# Altium schematic sheet DM0250_BW235_OV_9282.SchDoc: =project_title
size Tabloid; PageSetup: Record=PageOptions|CenterHorizontal=True|CenterVertical=True|PrintScale=0.71|XCorrection=1.00|YCorrection=1.00|PrintKind=0|BorderSize=5000000|LeftOffset=0|BottomOffset=0|Orientation=2|PaperLength=1000|PaperWidth=1000|Scale=100|PaperSource=7|PrintQuality=-4|MediaType=1|DitherType=10|PrintScaleMode=1|PaperKind=A4; CompanyName: Luxonis Holding; Organization: Luxonis Holding; Address1: 1925 Harmony Park Drive; Address2: Westminster, CO; Address3: 80234; Address4: United States; SheetNumber: 3; SheetTotal: 3
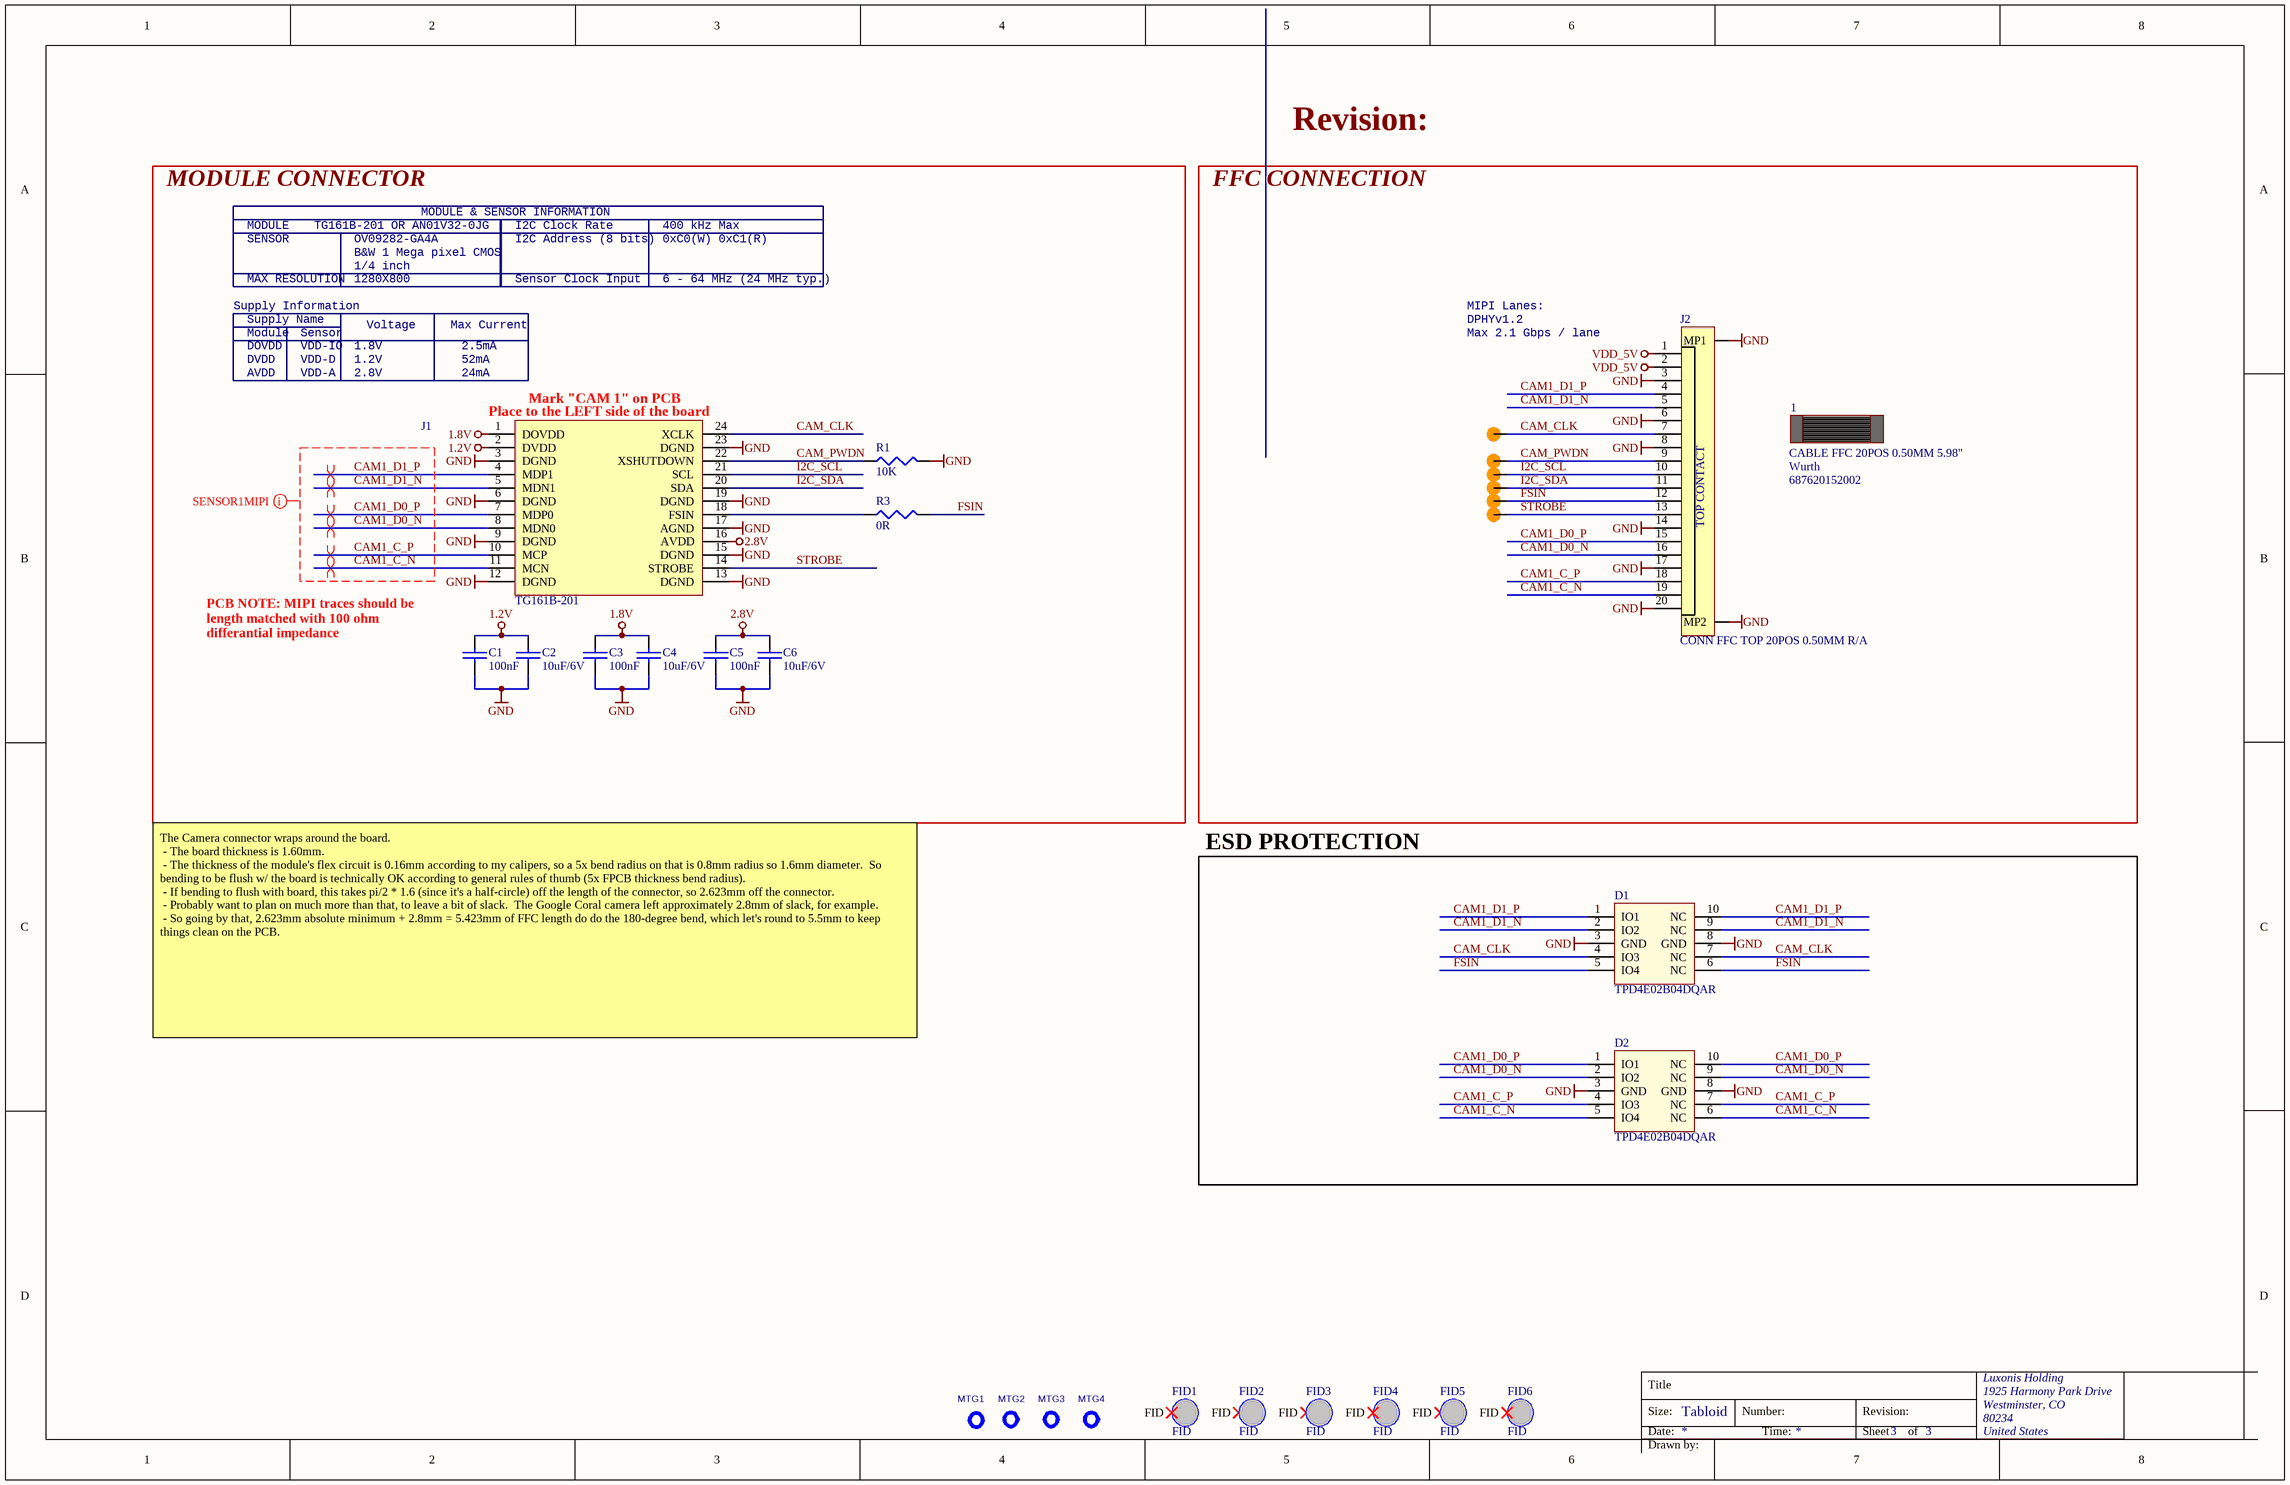
[diagram p0: DM0250_BW235_OV_9282.SchDoc]

## Parts
1  687620152002  ICCO PN: CABLE FFC 20POS 0.50MM 5.98"  MAN: Wurth  (mechanical)
C1  100nF  [0402]
C2  10uF/6V  [0603]
C3  100nF  [0402]
C4  10uF/6V  [0603]
C5  100nF  [0402]
C6  10uF/6V  [0603]
D1  TPD4E02B04DQAR  [TPD4E02B04DQAR]
D2  TPD4E02B04DQAR  [TPD4E02B04DQAR]
FID1  FID  [FIDUCIAL_1MM]  (no BOM)
FID2  FID  [FIDUCIAL_1MM]  (no BOM)
FID3  FID  [FIDUCIAL_1MM]  (no BOM)
FID4  FID  [FIDUCIAL_1MM]  (no BOM)
FID5  FID  [FIDUCIAL_1MM]  (no BOM)
FID6  FID  [FIDUCIAL_1MM]  (no BOM)
J1  TG161B-201  [TG161B-201 / AN01V32 - Board Wrap]
J2  CONN FFC TOP 20POS 0.50MM R/A  [5052782033]
MTG1  MTG-HOLE  [Hole_2.2mm]  (value not drawn)  (no BOM)
MTG2  MTG-HOLE  [Hole_2.2mm]  (value not drawn)  (no BOM)
MTG3  MTG-HOLE  [Hole_2.2mm]  (value not drawn)  (no BOM)
MTG4  MTG-HOLE  [Hole_2.2mm]  (value not drawn)  (no BOM)
R1  10K  [0603]
R3  0R  [0603]
TP1  TP_SMD  [TP_0.75MM_SMD_NO-SILK]  (value not drawn)  (no BOM)
TP2  TP_SMD  [TP_0.75MM_SMD_NO-SILK]  (value not drawn)  (no BOM)
TP3  TP_SMD  [TP_0.75MM_SMD_NO-SILK]  (value not drawn)  (no BOM)
TP4  TP_SMD  [TP_0.75MM_SMD_NO-SILK]  (value not drawn)  (no BOM)
TP5  TP_SMD  [TP_0.75MM_SMD_NO-SILK]  (value not drawn)  (no BOM)
TP6  TP_SMD  [TP_0.75MM_SMD_NO-SILK]  (value not drawn)  (no BOM)

## Blocks framed on the sheet
MODULE CONNECTOR: C1-C6 J1 R1 R3
FFC CONNECTION: 1 J2 TP1-TP6
ESD PROTECTION: D1 D2

## Nets
1.2V: C1.2 C2.2 J1.2(DVDD)
1.8V: C3.2 C4.2 J1.1(DOVDD)
2.8V: C5.2 C6.2 J1.16(AVDD)
GND: C1.1 C2.1 C3.1 C4.1 C5.1 C6.1 D1.3(GND) D1.8(GND) D2.3(GND) D2.8(GND) J1.3(DGND) J1.6(DGND) J1.9(DGND) J1.12(DGND) J1.13(DGND) J1.15(DGND) J1.17(AGND) J1.19(DGND) J1.23(DGND) J2.3 J2.6 J2.8 J2.14 J2.17 J2.20 J2.MP1 J2.MP2 R1.2
VDD_5V: J2.1 J2.2
CAM1_C_N: D2.5(IO4) D2.6(NC) J1.11(MCN) J2.19
CAM1_C_P: D2.4(IO3) D2.7(NC) J1.10(MCP) J2.18
CAM1_D0_N: D2.2(IO2) D2.9(NC) J1.8(MDN0) J2.16
CAM1_D0_P: D2.1(IO1) D2.10(NC) J1.7(MDP0) J2.15
CAM1_D1_N: D1.2(IO2) D1.9(NC) J1.5(MDN1) J2.5
CAM1_D1_P: D1.1(IO1) D1.10(NC) J1.4(MDP1) J2.4
CAM_CLK: D1.4(IO3) D1.7(NC) J1.24(XCLK) J2.7 TP1.1
CAM_PWDN: J1.22(XSHUTDOWN) J2.9 R1.1 TP2.1
FSIN: D1.5(IO4) D1.6(NC) J2.12 R3.2 TP5.1
I2C_SCL: J1.21(SCL) J2.10 TP3.1
I2C_SDA: J1.20(SDA) J2.11 TP4.1
STROBE: J1.14(STROBE) J2.13 TP6.1
NetJ1_18: J1.18(FSIN) R3.1

Not connected (* = marked no-connect by the designer): FID1 FID*; FID2 FID*; FID3 FID*; FID4 FID*; FID5 FID*; FID6 FID*

## Layout directives
differential pair: CAM1_C_N, CAM1_C_P, CAM1_D0_N, CAM1_D0_P, CAM1_D1_N, CAM1_D1_P
net class SENSOR1MIPI: CAM1_C_N, CAM1_C_P, CAM1_D0_N, CAM1_D0_P, CAM1_D1_N, CAM1_D1_P

## Notes on the sheet
- Revision:
- MODULE
- TG161B-201 OR AN01V32-0JG
- MODULE & SENSOR INFORMATION
- I2C Clock Rate
- 400 kHz Max
- SENSOR
- MAX RESOLUTION
- B&W 1 Mega pixel CMOS
- 1280X800
- OV09282-GA4A
- 1/4 inch
- I2C Address (8 bits)
- Sensor Clock Input
- 6 - 64 MHz (24 MHz typ.)
- 0xC0(W) 0xC1(R)
- Supply Information
- DOVDD
- DVDD
- Supply Name
- Module
- VDD-IO
- VDD-D
- Sensor
- 1.8V
- 1.2V
- Voltage
- Max Current
- 2.5mA
- 52mA
- MIPI Lanes:
- Max 2.1 Gbps / lane
- DPHYv1.2
- AVDD
- VDD-A
- 2.8V
- 24mA
- (near J1) Place to the LEFT side of the board
- (near J1) Mark "CAM 1" on PCB
- (near C1) PCB NOTE: MIPI traces should be length matched with 100 ohm differantial impedance
- The Camera connector wraps around the board.
  - The board thickness is 1.60mm.
  - The thickness of the module's flex circuit is 0.16mm according to my calipers, so a 5x bend radius on that is 0.8mm radius so 1.6mm diameter.  So bending to be flush w/ the board is technically OK according to general rules of thumb (5x FPCB thickness bend radius).
  - If bending to flush with board, this takes pi/2 * 1.6 (since it's a half-circle) off the length of the connector, so 2.623mm off the connector.
  - Probably want to plan on much more than that, to leave a bit of slack.  The Google Coral camera left approximately 2.8mm of slack, for example.
  - So going by that, 2.623mm absolute minimum + 2.8mm = 5.423mm of FFC length do do the 180-degree bend, which let's round to 5.5mm to keep things clean on the PCB.
- Title
- Size:
- Date:
- Tabloid
- Number:
- Time:
- Sheet
- of
- Drawn by:
- (in symbol 5052782033) TOP CONTACT

## Library data of the parts
1 = 26 pin FFC cable 15cm: 20 pin FFC cable 15cm; DIST: DigiKey; DIST PN: 732-5165-ND; MAN PN: 687620152002; Manufacturer 1: Wurth; Manufacturer Part Number 1: 687620152002
C1 C3 C5 = CAP: SMD Multilayer Ceramic Capacitor, 0402 [1005 Metric], 0.1 µF, 10 V, ± 10%, X5R; MAN: Kemet; MAN PN: C0402C104K8PACTU; ICCO PN: MV122005; DIST: Farnell; DIST PN: 2392235; Manufacturer 1: Kemet; Manufacturer Part Number 1: C0402C104K8PACTU
C2 C4 C6 = CAP: CC0603MRX5R5BB106  SMD Multilayer Ceramic Capacitor, 0603 [1608 Metric], 10 µF, 6.3 V, ± 20%, X5R; MAN: Yageo(PHYCOM); ICCO PN: MV122009; DIST: Farnell; DIST PN: 1458902; MAN PN: CC0603MRX5R5BB106; Manufacturer 1: Yageo(PHYCOM); Manufacturer Part Number 1: CC0603MRX5R5BB106
D1 D2 = TPD4E02B04DQAR: TVS DIODE 3.6V 8.8V 10USON 8.8V (Typ) Clamp 5A (8/20µs) Ipp Tvs Diode Surface Mount 10-USON (2.5x1); Manufacturer 1: Texas Instruments; Number of Bidirectional Channels: 4; Min Breakdown Voltage: 5.5V; Peak Pulse Power: 17W; Power Line Protection: No; Interface: USB,HDMI; Supplier 1: Digi-Key; Manufacturer Part Number 1: TPD4E02B04DQAR; Stock 1: 25615; Pricing 1: 1=0.69000, 10=0.60800, 100=0.46650, 500=0.36874, 1000=0.29499 (USD); RoHS: Yes; Mount: Surface Mount; Number of Pins: 10; Min Operating Temperature: -40°C; Max Operating Temperature: 125°C; Packaging: Cut Tape; Reverse Standoff Voltage: 3.6V; Clamping Voltage: 8.8V; Operating Supply Voltage: 3.6V; Peak Pulse Current: 5A; Number of Channels: 4; Composition: Zener; REACH SVHC: No SVHC; Lead Free: Lead Free; ComponentLink1URL: http://www.ti.com/general/docs/lit/getliterature.tsp?genericPartNumber=TPD4E02B04&amp;&amp;fileType=pdf&src-supplier=Element14; ComponentLink1Description: http://www.ti.com/general/docs/lit/getliterature.tsp?genericPartNumber=TPD4E02B04&amp;&amp;fileType=pdf&src-supplier=Element14; ComponentLink2URL: http://www.ti.com/lit/ds/symlink/tpd4e02b04.pdf?src-supplier=Farnell; ComponentLink2Description: http://www.ti.com/lit/ds/symlink/tpd4e02b04.pdf?src-supplier=Farnell; ComponentLink3URL: http://www.ti.com/lit/ds/symlink/tpd4e02b04.pdf?src-supplier=Newark; ComponentLink3Description: http://www.ti.com/lit/ds/symlink/tpd4e02b04.pdf?src-supplier=Newark; ComponentLink4URL: http://www.ti.com/lit/ds/symlink/tpd4e02b04.pdf?src-supplier=Digi-Key; ComponentLink4Description: http://www.ti.com/lit/ds/symlink/tpd4e02b04.pdf?src-supplier=Digi-Key; Supplier Part Number 1: 296-43875-1-ND
FID1-FID6 = FID: Fiducial mark; MAN PN: No part on PCB; MAN: Fiducial
J1 = TG161B-201: 24 way, 2row baord to board connector SMD; Manufacturer 1: ACON; Manufacturer Part Number 1: BBR43-24KB533; ICCO PN: MV250003; DIST: Sunny; DIST PN: BBR43-24KB533
J2 = 5052782033: 0.5 Ffc Zif Btm Cont Embt Pkg 0.5 Fpc Zif Btm FS19; Manufacturer 1: Molex; Manufacturer Part Number 1: 505278-2033; Actuator Material: Nylon,Glass,Polyamide; Number of Positions: 20; Voltage Rating: 50V; Current Rating: 500mA; Pitch: 0.02inch; Supplier 1: Digi-Key; RoHS: Yes; Category: Connectors; Stock 1: 13841; Pricing 1: 1=0,71000, 10=0,59800, 100=0,46540, 1000=0,36564 (USD); Mount: Surface Mount; Contact Plating: Tin; Contact Material: Bronze; Housing Material: Polymer; Min Operating Temperature: -40°C; Max Operating Temperature: 85°C; Packaging: Tape and Reel; Termination: Solder; Flammability Rating: UL94 V-0; ComponentLink1URL: http://www.molex.com/pdm_docs/sd/5052782033_sd.pdf?src-supplier=Digi-Key; ComponentLink1Description: http://www.molex.com/pdm_docs/sd/5052782033_sd.pdf?src-supplier=Digi-Key
MTG1-MTG4 = MTG-HOLE-NO-PLATE: Mounting Hole
R1 = RES1: SMD Chip Resistor, 10 kohm, 75 V, 0603 [1608 Metric], 100 mW, ± 1%; MAN: Walsin; MAN PN: WR06X1002FTL; ICCO PN: MV122008; DIST: Farnell; DIST PN: 2502397; Manufacturer 1: Walsin; Manufacturer Part Number 1: WR06X1002FTL
R3 = RES1: SMD Chip Resistor, Thick Film, 0 ohm, 75 V, 0603 [1608 Metric], 100 mW; MAN: Panasonic; MAN PN: ERJ3GEY0R00V; ICCO PN: MV122003; DIST: Farnell; DIST PN: 2059527RL; Manufacturer 1: Panasonic; Manufacturer Part Number 1: ERJ3GEY0R00V
TP1-TP6 = TP_SMD: circular pad test point, SMD